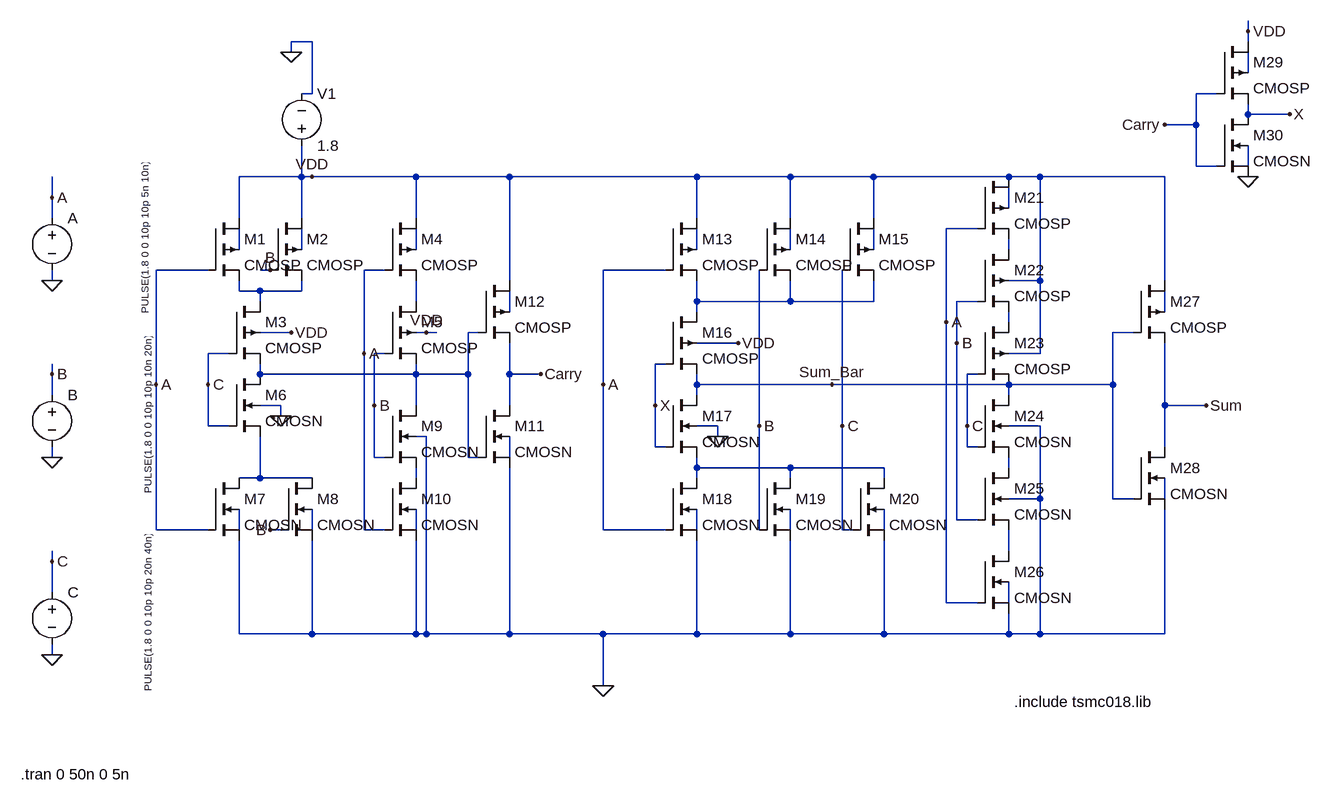
[diagram p0: schematic CMOS Full Adder[1].asc]
CMOS Full Adder[1].asc, the LTspice schematic file:
Version 4
SHEET 1 1688 904
WIRE 1488 -256 1488 -272
WIRE 48 -240 16 -240
WIRE 1488 -240 1488 -256
WIRE 16 -224 16 -240
WIRE 1488 -192 1488 -224
WIRE 48 -160 48 -240
WIRE 48 -160 32 -160
WIRE 1440 -160 1408 -160
WIRE 1488 -128 1488 -144
WIRE 1552 -128 1488 -128
WIRE 1408 -112 1408 -160
WIRE 1408 -112 1360 -112
WIRE 1408 -48 1408 -112
WIRE 1440 -48 1408 -48
WIRE 1488 -48 1488 -80
WIRE 32 -32 32 -80
WIRE 32 -32 -64 -32
WIRE 48 -32 32 -32
WIRE 208 -32 48 -32
WIRE 352 -32 208 -32
WIRE 640 -32 352 -32
WIRE 784 -32 640 -32
WIRE 912 -32 784 -32
WIRE 1120 -32 912 -32
WIRE 1168 -32 1120 -32
WIRE 1360 -32 1168 -32
WIRE -352 0 -352 -32
WIRE 1120 16 1120 -16
WIRE -352 32 -352 0
WIRE -64 32 -64 -32
WIRE 32 32 32 -32
WIRE 208 32 208 -32
WIRE 640 32 640 -32
WIRE 784 32 784 -32
WIRE 912 32 912 -32
WIRE 1072 48 1024 48
WIRE -64 80 -64 48
WIRE 32 80 32 48
WIRE 208 80 208 48
WIRE 640 80 640 48
WIRE 784 80 784 48
WIRE 912 80 912 48
WIRE 1120 80 1120 64
WIRE -112 112 -192 112
WIRE -16 112 -32 112
WIRE 160 112 128 112
WIRE 592 112 496 112
WIRE -352 128 -352 112
WIRE 352 128 352 -32
WIRE 1168 128 1168 -32
WIRE 1168 128 1120 128
WIRE 1360 128 1360 -32
WIRE -64 144 -64 128
WIRE -32 144 -64 144
WIRE 32 144 32 128
WIRE 32 144 -32 144
WIRE -32 160 -32 144
WIRE 208 160 208 128
WIRE 640 160 640 128
WIRE 784 160 784 128
WIRE 784 160 640 160
WIRE 912 160 912 128
WIRE 912 160 784 160
WIRE 1072 160 1040 160
WIRE 352 176 352 144
WIRE 640 176 640 160
WIRE 1360 176 1360 144
WIRE 1024 192 1024 48
WIRE 1120 192 1120 176
WIRE 16 208 -32 208
WIRE 224 208 208 208
WIRE 240 208 224 208
WIRE 304 208 288 208
WIRE 1312 208 1280 208
WIRE 704 224 640 224
WIRE 1040 224 1040 160
WIRE -80 240 -112 240
WIRE 128 240 128 112
WIRE 160 240 144 240
WIRE 1168 240 1168 128
WIRE 1168 240 1120 240
WIRE 592 256 576 256
WIRE -352 272 -352 256
WIRE -32 272 -32 256
WIRE 208 272 208 256
WIRE 208 272 -32 272
WIRE 288 272 288 208
WIRE 288 272 208 272
WIRE 352 272 352 224
WIRE 400 272 352 272
WIRE 1072 272 1056 272
WIRE -192 288 -192 112
WIRE -112 288 -112 240
WIRE 496 288 496 112
WIRE 640 288 640 272
WIRE 848 288 640 288
WIRE 1120 288 848 288
WIRE 1280 288 1280 208
WIRE 1280 288 1120 288
WIRE -352 304 -352 272
WIRE 640 304 640 288
WIRE 1120 304 1120 288
WIRE 0 320 -32 320
WIRE 144 320 144 240
WIRE 208 320 208 272
WIRE 352 320 352 272
WIRE 576 320 576 256
WIRE 1360 320 1360 224
WIRE 1424 320 1360 320
WIRE 0 336 0 320
WIRE -112 352 -112 288
WIRE -80 352 -112 352
WIRE 672 352 640 352
WIRE 736 352 736 112
WIRE 864 352 864 112
WIRE 1056 352 1056 272
WIRE 1168 352 1120 352
WIRE 224 368 208 368
WIRE 672 368 672 352
WIRE 576 384 576 320
WIRE 592 384 576 384
WIRE 1056 384 1056 352
WIRE 1072 384 1056 384
WIRE 1360 384 1360 320
WIRE -352 400 -352 384
WIRE 144 400 144 320
WIRE 160 400 144 400
WIRE 288 400 288 272
WIRE 304 400 288 400
WIRE 352 400 352 368
WIRE 640 416 640 400
WIRE 784 416 640 416
WIRE 928 416 784 416
WIRE 1120 416 1120 400
WIRE -32 432 -32 368
WIRE -32 432 -64 432
WIRE 48 432 -32 432
WIRE 208 432 208 416
WIRE 640 432 640 416
WIRE 784 432 784 416
WIRE 928 432 928 416
WIRE 1168 464 1168 352
WIRE 1168 464 1120 464
WIRE 1280 464 1280 288
WIRE 1312 464 1280 464
WIRE 1360 464 1360 432
WIRE 1040 496 1040 224
WIRE 1072 496 1040 496
WIRE -192 512 -192 288
WIRE -112 512 -192 512
WIRE -64 512 -64 480
WIRE 0 512 -16 512
WIRE 48 512 48 480
WIRE 128 512 128 240
WIRE 160 512 128 512
WIRE 208 512 208 480
WIRE 496 512 496 288
WIRE 592 512 496 512
WIRE 640 512 640 480
WIRE 736 512 736 352
WIRE 784 512 784 480
WIRE 864 512 864 352
WIRE 880 512 864 512
WIRE 928 512 928 480
WIRE 1120 544 1120 512
WIRE -352 560 -352 544
WIRE -352 608 -352 560
WIRE 1024 624 1024 192
WIRE 1072 624 1024 624
WIRE 1120 624 1120 592
WIRE -64 672 -64 528
WIRE 48 672 48 528
WIRE 48 672 -64 672
WIRE 208 672 208 528
WIRE 208 672 48 672
WIRE 224 672 224 368
WIRE 224 672 208 672
WIRE 352 672 352 416
WIRE 352 672 224 672
WIRE 496 672 352 672
WIRE 640 672 640 528
WIRE 640 672 496 672
WIRE 784 672 784 528
WIRE 784 672 640 672
WIRE 928 672 928 528
WIRE 928 672 784 672
WIRE 1120 672 1120 640
WIRE 1120 672 928 672
WIRE 1168 672 1168 464
WIRE 1168 672 1120 672
WIRE 1360 672 1360 480
WIRE 1360 672 1168 672
WIRE -352 704 -352 688
WIRE 496 752 496 672
FLAG 0 336 0
FLAG 16 208 VDD
FLAG 16 -224 0
FLAG 48 -32 VDD
FLAG -192 288 A
FLAG -112 288 C
FLAG -16 112 B
FLAG -16 512 B
FLAG 224 208 VDD
FLAG 400 272 Carry
FLAG 672 368 0
FLAG 704 224 VDD
FLAG 496 288 A
FLAG 576 320 X
FLAG 1024 192 A
FLAG 1040 224 B
FLAG 1056 352 C
FLAG 128 240 A
FLAG 144 320 B
FLAG 848 288 Sum_Bar
FLAG 496 752 0
FLAG 1424 320 Sum
FLAG -352 0 A
FLAG -352 128 0
FLAG -352 400 0
FLAG -352 704 0
FLAG -352 272 B
FLAG -352 560 C
FLAG 736 352 B
FLAG 864 352 C
FLAG 1488 -32 0
FLAG 1488 -256 VDD
FLAG 1360 -112 Carry
FLAG 1552 -128 X
SYMBOL cmosp -112 32 R0
SYMATTR InstName M1
SYMATTR Value2 l=180n w=3200n
SYMBOL cmosp -16 32 R0
SYMATTR InstName M2
SYMATTR Value2 l=180n w=3200n
SYMBOL cmosp -80 160 R0
SYMATTR InstName M3
SYMATTR Value2 l=180n w=3200n
SYMBOL cmosp 160 32 R0
SYMATTR InstName M4
SYMATTR Value2 l=180n w=3200n
SYMBOL cmosp 160 160 R0
SYMATTR InstName M5
SYMATTR Value2 l=180n w=3200n
SYMBOL cmosn -80 272 R0
SYMATTR InstName M6
SYMATTR Value2 l=180n w=1600n
SYMBOL cmosn -112 432 R0
SYMATTR InstName M7
SYMATTR Value2 l=180n w=1600n
SYMBOL cmosn 0 432 R0
SYMATTR InstName M8
SYMATTR Value2 l=180n w=1600n
SYMBOL cmosn 160 320 R0
SYMATTR InstName M9
SYMATTR Value2 l=180n w=1600n
SYMBOL cmosn 160 432 R0
SYMATTR InstName M10
SYMATTR Value2 l=180n w=1600n
SYMBOL cmosn 304 320 R0
SYMATTR InstName M11
SYMATTR Value2 l=180n w=400n
SYMBOL cmosp 304 128 R0
SYMATTR InstName M12
SYMATTR Value2 l=180n w=800n
SYMBOL voltage 32 -64 M180
WINDOW 0 24 96 Left 2
WINDOW 3 24 16 Left 2
WINDOW 123 0 0 Left 0
WINDOW 39 0 0 Left 0
SYMATTR InstName V1
SYMATTR Value 1.8
SYMBOL cmosp 592 32 R0
SYMATTR InstName M13
SYMATTR Value2 l=180n w=1600n
SYMBOL cmosp 736 32 R0
SYMATTR InstName M14
SYMATTR Value2 l=180n w=1600n
SYMBOL cmosp 864 32 R0
SYMATTR InstName M15
SYMATTR Value2 l=180n w=1600n
SYMBOL cmosp 592 176 R0
SYMATTR InstName M16
SYMATTR Value2 l=180n w=1600n
SYMBOL cmosn 592 304 R0
SYMATTR InstName M17
SYMATTR Value2 l=180n w=800n
SYMBOL cmosn 592 432 R0
SYMATTR InstName M18
SYMATTR Value2 l=180n w=800n
SYMBOL cmosn 736 432 R0
SYMATTR InstName M19
SYMATTR Value2 l=180n w=800n
SYMBOL cmosn 880 432 R0
SYMATTR InstName M20
SYMATTR Value2 l=180n w=800n
SYMBOL cmosp 1072 -32 R0
SYMATTR InstName M21
SYMATTR Value2 l=180n w=2400n
SYMBOL cmosp 1072 80 R0
SYMATTR InstName M22
SYMATTR Value2 l=180n w=2400n
SYMBOL cmosp 1072 192 R0
SYMATTR InstName M23
SYMATTR Value2 l=180n w=2400n
SYMBOL cmosn 1072 304 R0
SYMATTR InstName M24
SYMATTR Value2 l=180n w=1200n
SYMBOL cmosn 1072 416 R0
SYMATTR InstName M25
SYMATTR Value2 l=180n w=1200n
SYMBOL cmosn 1072 544 R0
SYMATTR InstName M26
SYMATTR Value2 l=180n w=1200n
SYMBOL cmosp 1312 128 R0
SYMATTR InstName M27
SYMATTR Value2 l=180n w=800n
SYMBOL cmosn 1312 384 R0
SYMATTR InstName M28
SYMATTR Value2 l=180n w=400n
SYMBOL voltage -352 288 R0
WINDOW 3 148 168 VLeft 1
WINDOW 123 0 0 Left 0
WINDOW 39 0 0 Left 0
SYMATTR Value PULSE(1.8 0 0 10p 10p 10n 20n)
SYMATTR InstName B
SYMBOL voltage -352 592 R0
WINDOW 3 148 168 VLeft 1
WINDOW 123 0 0 Left 0
WINDOW 39 0 0 Left 0
SYMATTR Value PULSE(1.8 0 0 10p 10p 20n 40n)
SYMATTR InstName C
SYMBOL voltage -352 16 R0
WINDOW 3 143 163 VLeft 1
WINDOW 123 0 0 Left 0
WINDOW 39 0 0 Left 0
SYMATTR Value PULSE(1.8 0 0 10p 10p 5n 10n)
SYMATTR InstName A
SYMBOL cmosp 1440 -240 R0
SYMATTR InstName M29
SYMATTR Value2 l=180n w=800n
SYMBOL cmosn 1440 -128 R0
SYMATTR InstName M30
SYMATTR Value2 l=180n w=400n
TEXT -400 888 Left 2 !.tran 0 50n 0 5n
TEXT 1128 776 Left 2 !.include tsmc018.lib

The netlist it stands for:
* CMOS Full Adder[1].asc
M1 VDD A N011 N004 CMOSP l=180n w=3200n
M2 VDD B N011 N005 CMOSP l=180n w=3200n
M3 N011 C N017 VDD CMOSP l=180n w=3200n
M4 VDD A N012 N006 CMOSP l=180n w=3200n
M5 N012 B N017 VDD CMOSP l=180n w=3200n
M6 N017 C N021 0 CMOSN l=180n w=1600n
M7 N021 A 0 N024 CMOSN l=180n w=1600n
M8 N021 B 0 N025 CMOSN l=180n w=1600n
M9 N017 B N022 0 CMOSN l=180n w=1600n
M10 N022 A 0 N026 CMOSN l=180n w=1600n
M11 Carry N017 0 N018 CMOSN l=180n w=400n
M12 VDD N017 Carry N014 CMOSP l=180n w=800n
V1 VDD 0 1.8
M13 VDD A N013 N007 CMOSP l=180n w=1600n
M14 VDD B N013 N008 CMOSP l=180n w=1600n
M15 VDD C N013 N009 CMOSP l=180n w=1600n
M16 N013 X Sum_Bar VDD CMOSP l=180n w=1600n
M17 Sum_Bar X N019 0 CMOSN l=180n w=800n
M18 N019 A 0 N027 CMOSN l=180n w=800n
M19 N019 B 0 N028 CMOSN l=180n w=800n
M20 N019 C 0 N029 CMOSN l=180n w=800n
M21 VDD A N010 N003 CMOSP l=180n w=2400n
M22 N010 B N016 VDD CMOSP l=180n w=2400n
M23 N016 C Sum_Bar VDD CMOSP l=180n w=2400n
M24 Sum_Bar C N020 0 CMOSN l=180n w=1200n
M25 N020 B N030 0 CMOSN l=180n w=1200n
M26 N030 A 0 N031 CMOSN l=180n w=1200n
M27 VDD Sum_Bar Sum N015 CMOSP l=180n w=800n
M28 Sum Sum_Bar 0 N023 CMOSN l=180n w=400n
V§B B 0 PULSE(1.8 0 0 10p 10p 10n 20n)
V§C C 0 PULSE(1.8 0 0 10p 10p 20n 40n)
V§A A 0 PULSE(1.8 0 0 10p 10p 5n 10n)
M29 VDD Carry X N001 CMOSP l=180n w=800n
M30 X Carry 0 N002 CMOSN l=180n w=400n
.model NMOS NMOS
.model PMOS PMOS
.lib standard.mos
.tran 0 50n 0 5n
.include tsmc018.lib
.backanno
.end